# EAGLE design diagramaLogger (EAGLE 9.6.2)
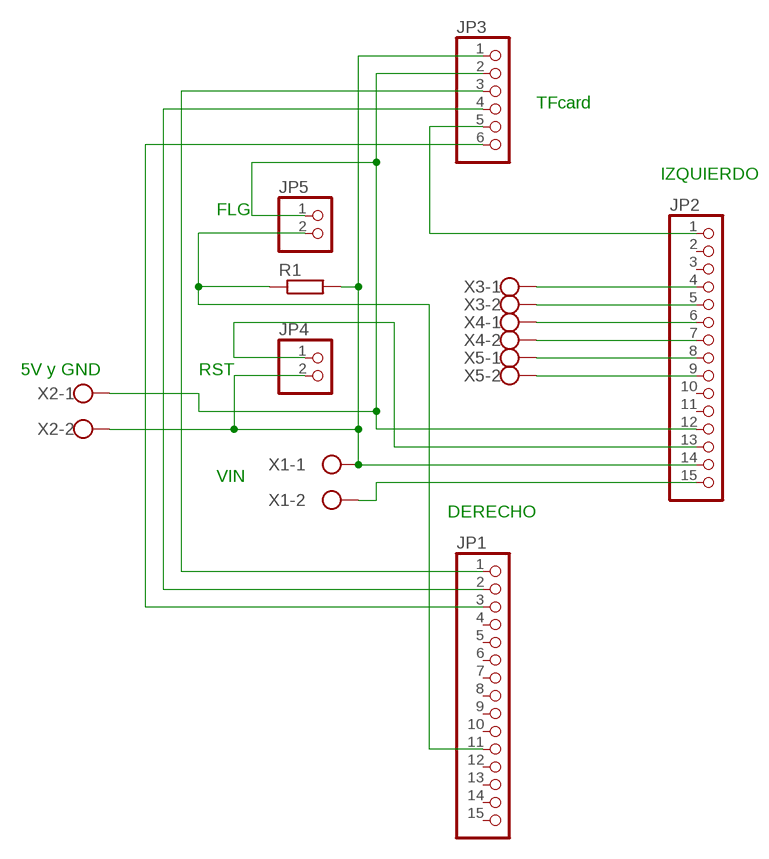
[diagram p0: schematic, sheet 1]

## Parts
JP1  PINHD-1X15  [1X15]
JP2  PINHD-1X15  [1X15]
JP3  PINHD-1X6  [1X06]
JP4  PINHD-1X2  [1X02]
JP5  PINHD-1X2  [1X02]
R1  R-EU_0411/12  [0411/12]
X1  W237-102  [W237-102]
X2  W237-102  [W237-102]
X3  W237-102  [W237-102]
X4  W237-102  [W237-102]
X5  W237-102  [W237-102]

## Nets
N$1: JP2.14 JP3.1 JP4.2 R1.2 X1.1 X2.2
N$2: JP2.15 X1.2
N$3: JP1.3 JP3.6
N$4: JP2.1 JP3.5
N$5: JP1.2 JP3.4
N$6: JP1.1 JP3.3
N$7: JP2.9 X5.2
N$8: JP1.11 JP5.2 R1.1
N$9: JP2.13 JP4.1
N$10: JP2.8 X5.1
N$11: JP2.12 JP3.2 JP5.1 X2.1
N$12: JP2.7 X4.2
N$13: JP2.6 X4.1
N$14: JP2.5 X3.2
N$15: JP2.4 X3.1
Unconnected: JP1.4 JP1.5 JP1.6 JP1.7 JP1.8 JP1.9 JP1.10 JP1.12 JP1.13 JP1.14 JP1.15 JP2.2 JP2.3 JP2.10 JP2.11

## Notes on the sheet
- TFcard
- IZQUIERDO
- FLG
- 5V y GND | RST
- VIN
- DERECHO

## Library data of the parts
JP1 JP2 = pinhead:PINHD-1X15: PIN HEADER
JP3 = pinhead:PINHD-1X6: PIN HEADER
JP4 JP5 = pinhead:PINHD-1X2: PIN HEADER
R1 = rcl:R-EU_: RESISTOR, European symbol; SPICEPREFIX: R
X1-X5 = con-wago-500:W237-102: WAGO SCREW CLAMP; MPN: 237-102; OC_FARNELL: unknown; OC_NEWARK: 70K9898

## Board
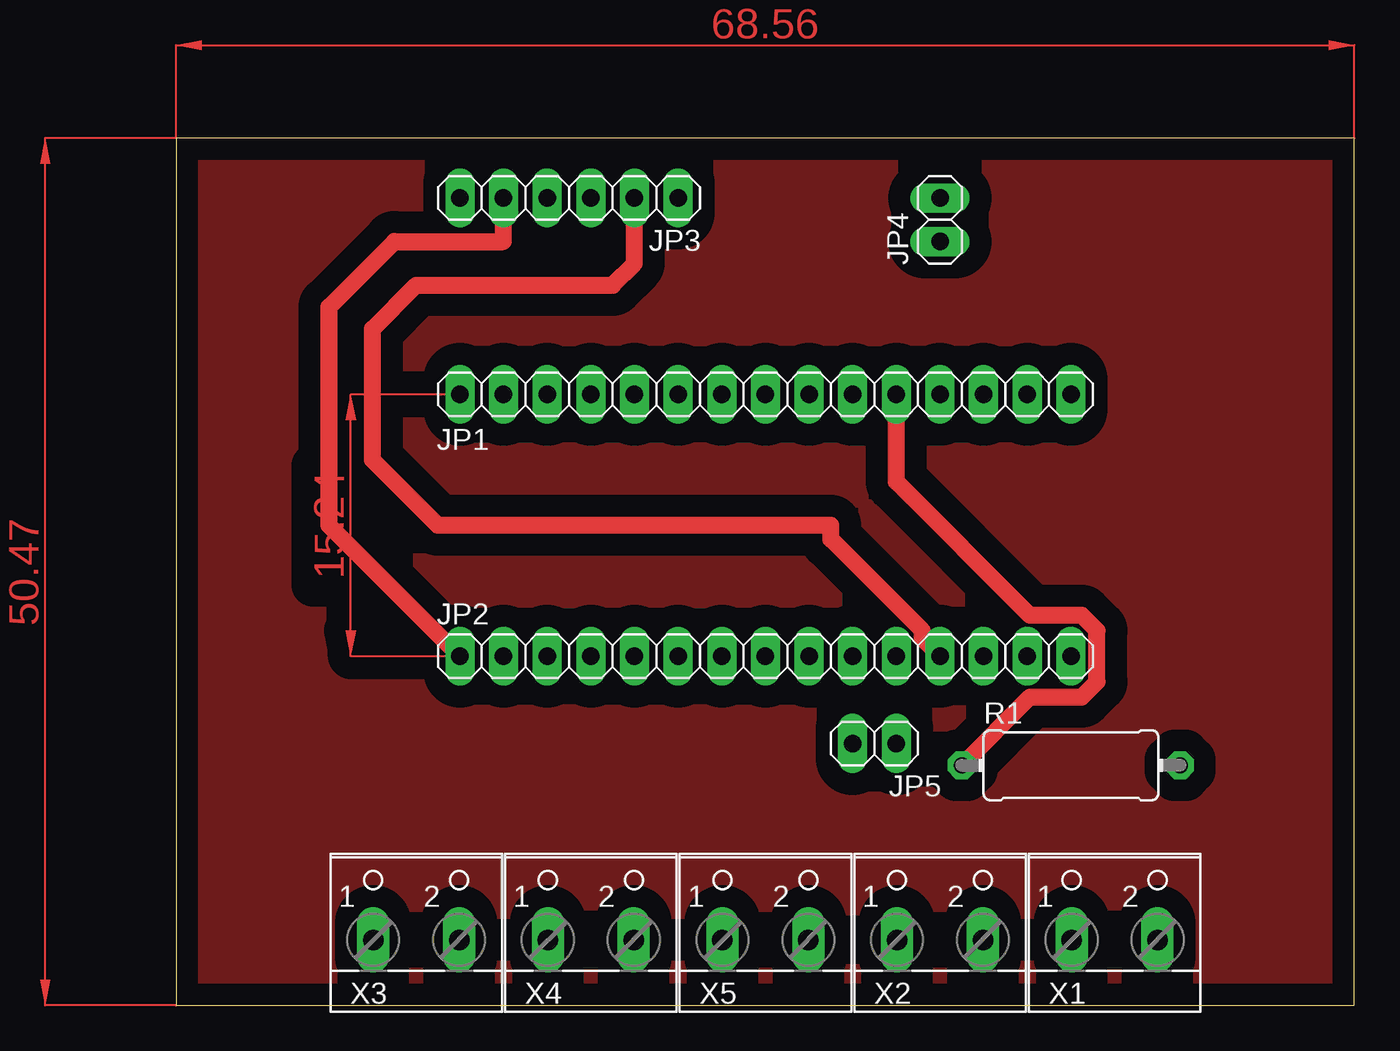
[diagram p1: board, top side]
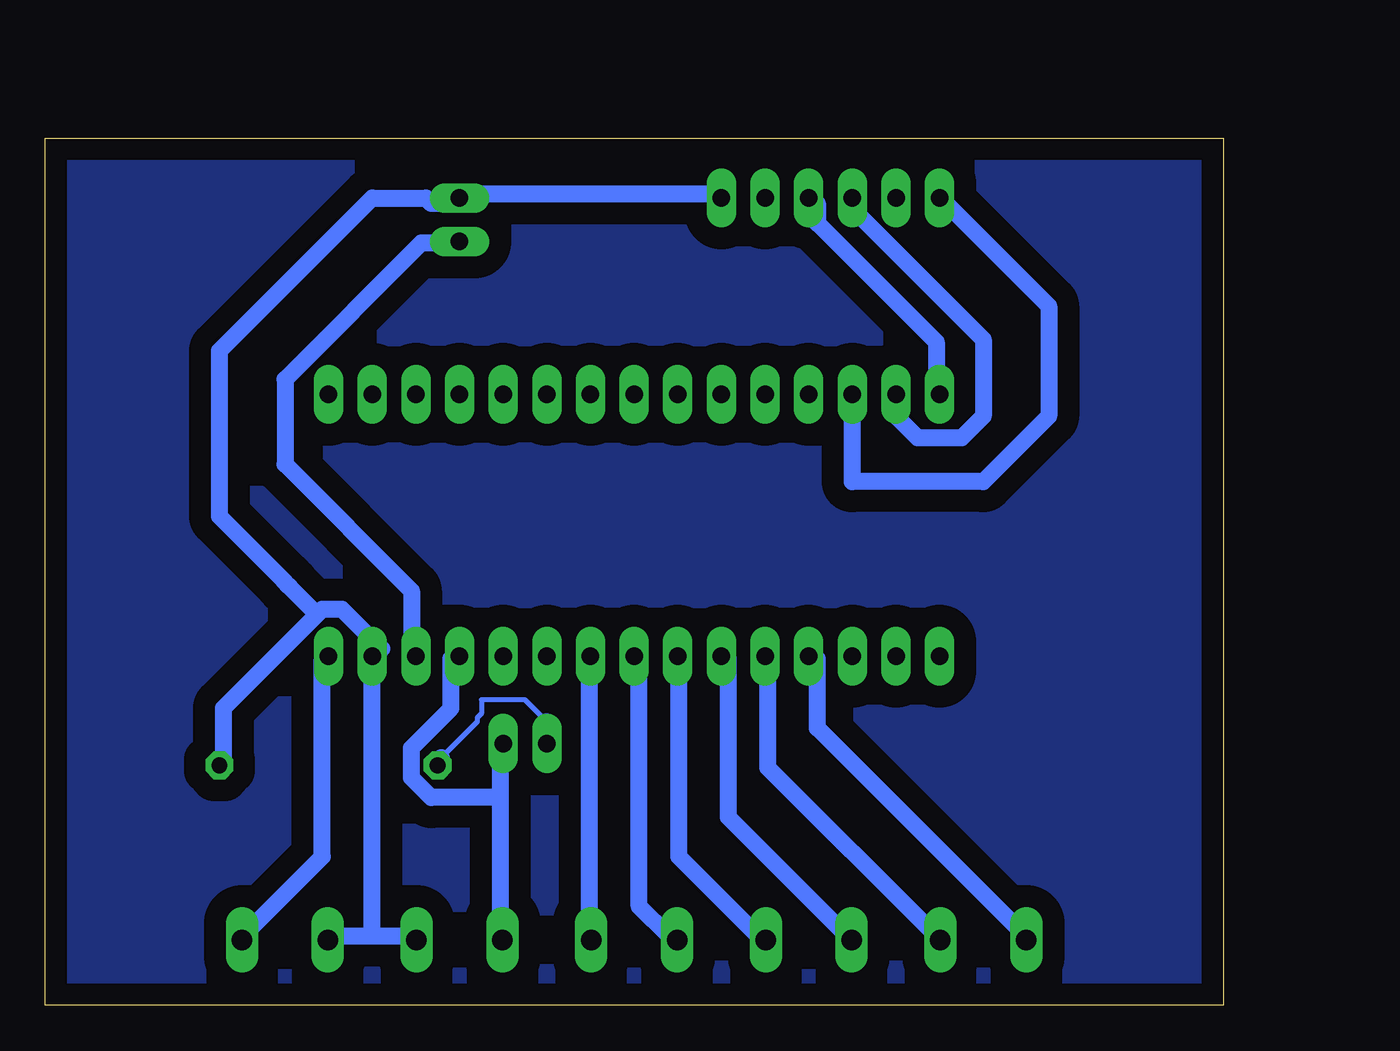
[diagram p2: board, bottom side, seen from below]

Size 68.56 x 50.47 mm. Coordinates in mm from the lower left corner, seen from the top.
Outline: 0,0 68.56,0 68.56,50.47 0,50.47 0,0
Copper layers (1*16): Top 0.035mm / dielectric 1.5mm / Bottom 0.035mm
Design rules "default *": minimum track width 1mm, minimum drill 0.35mm, track to track 6mil, track to pad 6mil, pad to pad 6mil, via to via 6mil, smd to smd 6mil, copper to edge 40mil, drill to drill 6mil, minimum pad ring 14mil, minimum via ring 8mil, stop-mask expansion 4mil, vias tented up to drill 0mil, thermal gap 10mil

### Footprints (pad centres in the part's own frame; a part is rotated, then mirrored left to right if it is on the bottom)
1X15 = drill 1.016 long: 1 -17.78,0; 2 -15.24,0; 3 -12.7,0; 4 -10.16,0; 5 -7.62,0; 6 -5.08,0; 7 -2.54,0; 8 0,0; 9 2.54,0; 10 5.08,0; 11 7.62,0; 12 10.16,0; 13 12.7,0; 14 15.24,0; 15 17.78,0
1X06 = drill 1.016 long: 1 -6.35,0; 2 -3.81,0; 3 -1.27,0; 4 1.27,0; 5 3.81,0; 6 6.35,0
1X02 = drill 1.016 long: 1 -1.27,0; 2 1.27,0
0411/12 = drill 0.914 octagon: 1 -6.35,0; 2 6.35,0
W237-102 = drill 1.194 long: 1 -2.5,-1.27; 2 2.5,-1.27

### Placement (x,y rotation side)
JP1  34.29,35.56 0 top
JP2  34.29,20.32 0 top
JP3  22.86,46.99 180 top
JP4  44.45,45.72 90 top
JP5  40.64,15.24 180 top
R1  52.07,13.97 0 top
X1  54.61,5.08 0 top
X2  44.45,5.08 0 top
X3  13.97,5.08 0 top
X4  24.13,5.08 0 top
X5  34.29,5.08 0 top

### Tracks (layer width: path | path; a pad name or v marks a point on that pad's centre or on a via)
GBP
  pour Bottom (isolate 1.27): 0,50.8 68.58,50.8 68.58,0 0,0
GTP
  pour Top (isolate 1.27, rank 6): 0,50.8 68.58,50.8 68.58,0 0,0
N$1
  Bottom 1: JP3.1 29.39,47.25 44.37,47.25 JP4.2 44.94,46.67 46.1,46.67 46.41,46.99 49.53,46.99 58.42,38.1 58.42,28.46 54.74,24.78 54.35,24.39 52.72,22.76 | 49.55,4.03 51.86,4.03 X1.1 | 49.55,4.03 47.25,4.03 X2.2 | 52.72,22.76 52.43,23.05 51.28,23.05 48.98,20.74 JP2.14 49.55,20.17 49.55,4.03 | 52.72,22.76 58.2,17.29 58.2,14.4 R1.2
N$2
  Bottom 1: JP2.15 52.43,20.17 52.43,8.64 57.04,4.03 X1.2
N$3
  Bottom 1: JP3.6 16.13,46.67 10.16,40.7 10.16,34.29 13.97,30.48 21.59,30.48 JP1.3 21.9,35.15
N$4
  Top 1: JP2.1 8.89,27.94 8.89,40.64 12.7,44.45 19.05,44.45 JP3.5
N$5
  Bottom 1: JP1.2 19.02,35.15 19.02,34.57 19.02,34.26 17.78,33.02 15.24,33.02 13.97,34.29 13.97,38.75 21.9,46.67 JP3.4
N$6
  Bottom 1: JP1.1 16.71,35.72 16.71,38.6 23.62,45.52 23.62,46.67 JP3.3
N$7
  Bottom 1: JP2.9 36.88,20.17 36.88,4.03 X5.2
N$8
  Top 1: R1.1 49.69,17.94 52.7,17.94 53.59,18.83 53.59,21.81 52.7,22.7 49.69,22.7 41.91,30.48 JP1.11
  Bottom 0.305: 39.37,16.51 40.64,17.78 43.18,17.78 43.18,16.98 43.43,16.73 43.43,16.5 45.52,14.4
  Bottom 1: 45.52,14.4 R1.1 | 39.18,15.56 JP5.2 39.37,16.51
N$9
  Bottom 1: JP2.13 47.25,20.74 47.25,24.13 54.61,31.49 54.61,36.43 46.67,44.37 44.94,44.37 JP4.1
N$10
  Bottom 1: JP2.8 34,20.17 34,5.76 32.27,4.03 X5.1
N$11
  Top 1: JP2.12 43.43,21.34 43.43,21.81 38.1,27.14 38.1,27.94 15.24,27.94 11.43,31.75 11.43,39.37 13.97,41.91 25.4,41.91 26.67,43.18 JP3.2
  Bottom 1: 42.06,12.1 42.06,4.03 X2.1 | 42.06,12.1 42.06,14.98 JP5.1 | 42.06,12.1 46.1,12.1 47.25,13.25 47.25,14.98 44.94,17.29 44.94,20.17 JP2.12
N$12
  Bottom 1: JP2.7 31.69,20.17 31.69,8.64 27.08,4.03 X4.2
N$13
  Bottom 1: JP2.6 28.81,20.17 28.81,10.95 21.9,4.03 X4.1
N$14
  Bottom 1: JP2.5 26.5,20.17 26.5,13.83 16.71,4.03 X3.2
N$15
  Bottom 1: JP2.4 23.62,20.17 23.62,16.13 11.52,4.03 X3.1
(copper drawn outside any net)
  shapes: Top area x3